# Altium schematic sheet МИЭТ_444_Лист_1.SchDoc: Lab1
size 420 x 297 mm; Date: 03.07.2022; ApprovedBy: МИНОБОРОНЫ; CheckedBy: Желобаев А.Л; Author: Максимов Артем; DrawnBy: Максимов Артем ИВТ-22; Engineer: Кто-нибудь точно; DocumentNumber: МИЭТ_444_Лист_1; SheetNumber: x; SheetTotal: x; Time: 1123; DocumentName: Sheet1.SCHDOC
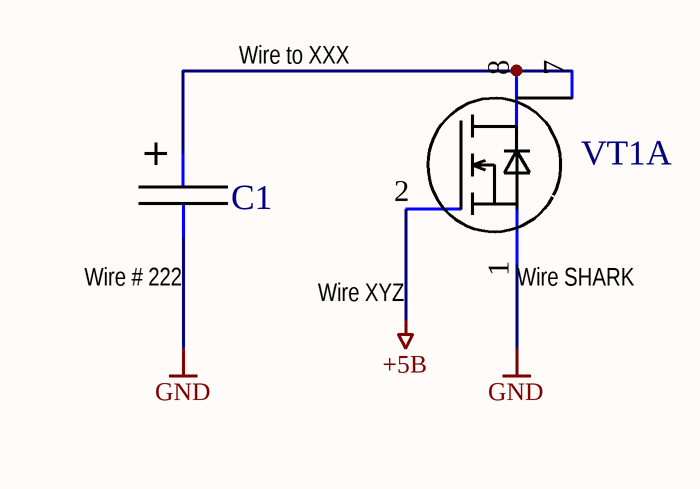
[diagram p0: МИЭТ_444_Лист_1.SchDoc]

## Parts
C1  (no value)  [D-Tantal]
VT1  (no value)  [4320-8-N]  (part A of 2)

## Nets
Wire # 222: C1.- VT1.1(S)  [also labelled GND, Wire SHARK]
Wire XYZ: VT1.2(G)  [also labelled +5В]
Wire to XXX: C1.+ VT1.7(D) VT1.8(D)

## Notes on the sheet
- Перв.примен.
- Справ. №
- Подп. и дата
- Инв.№ дубл.
- Взам. инв. №
- Изм.
- Лист
- № докум.
- Подп.
- Дата
- Лит.
- Масса
- Масштаб
- Пров.
- Т.контр
- Разраб.
- Схема электрическая принципиальная
- 1
- Листов
- Инв № подл.
- Н.контр.
- Утв.
- Копировал
- Формат А3

## Library data of the parts
C1 = K53-65_D_10%: К53-65 Конденсатор танталовый D(7343) 1,5-330 мкФ; Manufacturer: ОАО "Элеконд"; TU: АЖЯР.673546.004 ТУ; Tolerance: 10%; BOM: К53-65 "D" - *B - *мкФ ±10% АЖЯР.673546.004 ТУ; Created_by: Желобаев; Name2: Конденсатор К53-65; Size: "D"; Value: *; Voltage: *; Name: К53-65; Weight: 0,5; Version: 0; Issue_date: 10.04.2019; Case: "D"
VT1 = 2П7240АС9: Транзисторная сборка с n-каналом; Manufacturer: ОАО "ВЗПП-С"; TU: АЕЯР.432140.605 ТУ; BOM: 2П7240АС9 АЕЯР.432140.605 ТУ; Voltage: 30; Created_by: Желобаев; Name2: Набор транзисторов 2П7240АС9; Name: 2П7240АС9; Version: 0; Issue_date: 10.04.2019; Case: 4320.8-A